# EAGLE design RTI-Dome-eth-ENC (EAGLE 7.7.0)

## Sheet 1 of 2
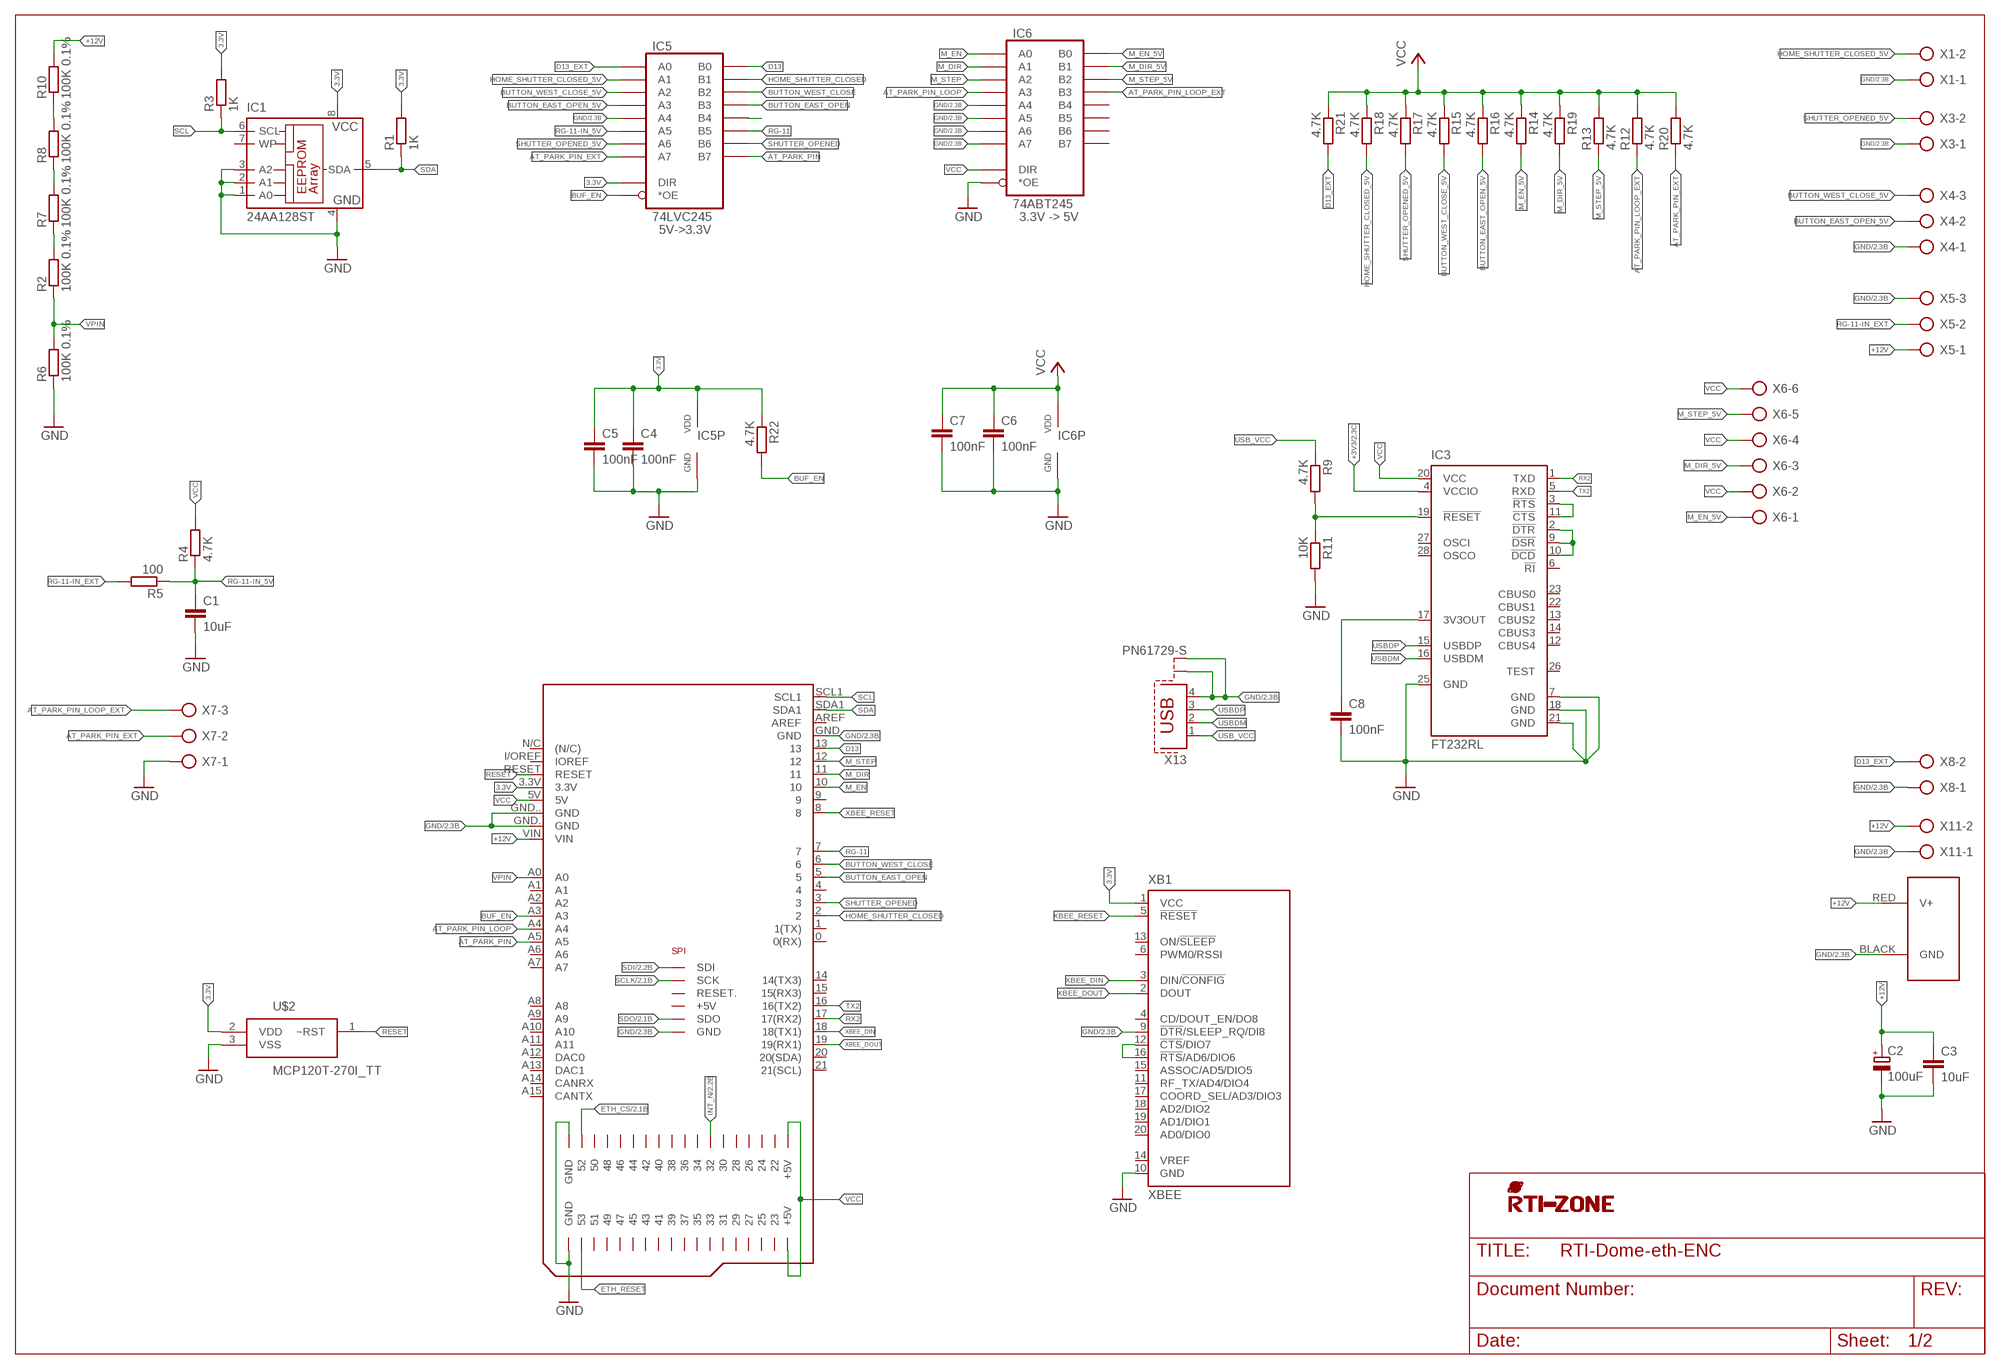
[diagram p0: schematic, sheet 1]

### Parts
C1  10uF  C-EU'0805'  [C0805]
C2  100uF  CPOL-EU  [UD-10X10_NICHICON]
C3  10uF  C-EU'0805'  [C0805]
C4  100nF  C-EU'0805'  [C0805]
C5  100nF  C-EU'0805'  [C0805]
C6  100nF  C-EU'0805'  [C0805]
C7  100nF  C-EU'0805'  [C0805]
C8  100nF  C-EU'0805'  [C0805]
IC1  24AA128ST  [TSSOP8]
IC3  FT232RL  [SSOP28]
IC5  74LVC245  [TSSOP20]
IC6  74ABT245  [TSSOP20]
J1  POWERPOLE_POWER45A  [POWERPOLE_PAIR_45A]
R1  1K  R-EU'0805'  [R0805]
R2  100K 0.1%  R-EU'0805'  [R0805]
R3  1K  R-EU'0805'  [R0805]
R4  4.7K  R-EU'0805'  [R0805]
R5  100  R-EU'0805'  [R0805]
R6  100K 0.1%  R-EU'0805'  [R0805]
R7  100K 0.1%  R-EU'0805'  [R0805]
R8  100K 0.1%  R-EU'0805'  [R0805]
R9  4.7K  R-EU'0805'  [R0805]
R10  100K 0.1%  R-EU'0805'  [R0805]
R11  10K  R-EU'0805'  [R0805]
R12  4.7K  R-EU'0805'  [R0805]
R13  4.7K  R-EU'0805'  [R0805]
R14  4.7K  R-EU'0805'  [R0805]
R15  4.7K  R-EU'0805'  [R0805]
R16  4.7K  R-EU'0805'  [R0805]
R17  4.7K  R-EU'0805'  [R0805]
R18  4.7K  R-EU'0805'  [R0805]
R19  4.7K  R-EU'0805'  [R0805]
R20  4.7K  R-EU'0805'  [R0805]
R21  4.7K  R-EU'0805'  [R0805]
R22  4.7K  R-EU'0805'  [R0805]
U$1  ARDUINO_DUE_SHIELD_FULL  [ARDUINO_DUE_SHIELD_FULL]
U$2  MCP120T-270I_TT  [SOT95P237X112-3N]
U$4  RTI-LOGO_BIG  [LOGO_BIG]
X1  AK500/2  [AK500/2]
X3  AK500/2  [AK500/2]
X4  AK500/3  [AK500/3]
X5  AK500/3  [AK500/3]
X6  AK500/6  [AK500/6]
X7  AK500/3  [AK500/3]
X8  AK500/2  [AK500/2]
X11  AK500/2  [AK500/2]
X13  PN61729-S  [PN61729-S]
XB1  XBEE  [XBEE]

### Nets
3.3V: C4.1 C5.1 IC1.8(VCC) IC5.P$1(DIR) IC5.P$20(VDD) R1.2 R3.2 R22.1 U$1.3.3V U$2.2(VDD) XB1.1(VCC)
+3V3 [+3V3]: IC3.4(VCCIO) ; also sheet 2
+12V [+12V]: C2.+ C3.1 J1.RED(V+) R10.2 U$1.VIN X5.1 X11.2
AT_PARK_PIN: IC5.P$11(B7) U$1.A5
AT_PARK_PIN_EXT: IC5.P$9(A7) R20.1 X7.2
AT_PARK_PIN_LOOP: IC6.P$5(A3) U$1.A4
AT_PARK_PIN_LOOP_EXT: IC6.P$15(B3) R12.1 X7.3
BUF_EN: IC5.P$19(*OE) R22.2 U$1.A3
BUTTON_EAST_OPEN: IC5.P$15(B3) U$1.5
BUTTON_EAST_OPEN_5V: IC5.P$5(A3) R16.2 X4.2
BUTTON_WEST_CLOSE: IC5.P$16(B2) U$1.6
BUTTON_WEST_CLOSE_5V: IC5.P$4(A2) R15.2 X4.3
D13: IC5.P$18(B0) U$1.13
D13_EXT: IC5.P$2(A0) R21.2 X8.2
DTR_DSR_DCD: IC3.2(!DTR) IC3.9(!DSR) IC3.10(!DCD)
ETH_CS: U$1.52 ; also sheet 2
ETH_RESET: U$1.53
GND [GND]: C1.2 C2.- C3.2 C4.2 C5.2 C6.2 C7.2 C8.2 IC1.1(A0) IC1.2(A1) IC1.3(A2) IC1.4(GND) IC3.7(GND) IC3.18(GND) IC3.21(GND) IC3.25(GND) IC5.P$6(A4) IC5.P$10(GND) IC6.P$6(A4) IC6.P$7(A5) IC6.P$8(A6) IC6.P$9(A7) IC6.P$10(GND) IC6.P$19(*OE) J1.BLACK(GND) R6.1 R11.2 U$1.GND U$1.GND.(GND) U$1.GND..(GND) U$1.GND...(GND) U$1.GND....(GND) U$1.GND__(GND) U$2.3(VSS) X1.1 X3.1 X4.1 X5.3 X7.1 X8.1 X11.1 X13.4 X13.S1 X13.S2 XB1.9(!DTR!/SLEEP_RQ/DI8) XB1.10(GND) ; also sheet 2
HOME_SHUTTER_CLOSED: IC5.P$17(B1) U$1.2
HOME_SHUTTER_CLOSED_5V: IC5.P$3(A1) R18.2 X1.2
INT_N: U$1.32 ; also sheet 2
M_DIR: IC6.P$3(A1) U$1.11
M_DIR_5V: IC6.P$17(B1) R19.2 X6.3
M_EN: IC6.P$2(A0) U$1.10
M_EN_5V: IC6.P$18(B0) R14.2 X6.1
M_STEP: IC6.P$4(A2) U$1.12
M_STEP_5V: IC6.P$16(B2) R13.1 X6.5
N$1: IC3.19(!RESET) R9.2 R11.1
N$2: R7.2 R8.1
N$3: R8.2 R10.1
N$4: IC5.P$14(B4)
N$5: R2.2 R7.1
N$6: C8.1 IC3.17(3V3OUT)
N$9: XB1.12(!CTS!/DIO7) XB1.16(!RTS!/AD6/DIO6)
RESET: U$1.RESET U$2.1(~RST)
RG-11: IC5.P$13(B5) U$1.7
RG-11-IN_5V: C1.1 IC5.P$7(A5) R4.1 R5.1
RG-11-IN_EXT: R5.2 X5.2
RTS_CTS: IC3.3(!RTS) IC3.11(!CTS)
RX2: IC3.1(TXD) U$1.17(17(RX2))
SCL: IC1.6(SCL) R3.1 U$1.SCL1
SCLK: U$1.SCK ; also sheet 2
SDA: IC1.5(SDA) R1.1 U$1.SDA1
SDI: U$1.MISO(SDI) ; also sheet 2
SDO: U$1.MOSI(SDO) ; also sheet 2
SHUTTER_OPENED: IC5.P$12(B6) U$1.3
SHUTTER_OPENED_5V: IC5.P$8(A6) R17.2 X3.2
TX2: IC3.5(RXD) U$1.16(16(TX2))
USB_VCC: R9.1 X13.1
USBDM: IC3.16(USBDM) X13.2
USBDP: IC3.15(USBDP) X13.3
VCC: C6.1 C7.1 IC3.20(VCC) IC6.P$1(DIR) IC6.P$20(VDD) R4.2 R12.2 R13.2 R14.1 R15.1 R16.1 R17.1 R18.1 R19.1 R20.2 R21.1 U$1.5V U$1.5V.(+5V) U$1.5V..(+5V) X6.2 X6.4 X6.6 ; also sheet 2
VPIN: R2.1 R6.2 U$1.A0
XBEE_DIN: U$1.18(18(TX1)) XB1.3(DIN/!CONFIG)
XBEE_DOUT: U$1.19(19(RX1)) XB1.2(DOUT)
XBEE_RESET: U$1.8 XB1.5(!RESET)
Unconnected: IC1.7(WP) IC3.6(!RI) IC3.12(CBUS4) IC3.13(CBUS2) IC3.14(CBUS3) IC3.22(CBUS1) IC3.23(CBUS0) IC3.26(TEST) IC3.27(OSCI) IC3.28(OSCO) IC6.P$11(B7) IC6.P$12(B6) IC6.P$13(B5) IC6.P$14(B4) U$1.0(0(RX)) U$1.1(1(TX)) U$1.4 U$1.9 U$1.14(14(TX3)) U$1.15(15(RX3)) U$1.20(20(SDA)) U$1.21(21(SCL)) U$1.22 U$1.23 U$1.24 U$1.25 U$1.26 U$1.27 U$1.28 U$1.29 U$1.30 U$1.31 U$1.33 U$1.34 U$1.35 U$1.36 U$1.37 U$1.38 U$1.39 U$1.40 U$1.41 U$1.42 U$1.43 U$1.44 U$1.45 U$1.46 U$1.47 U$1.48 U$1.49 U$1.50 U$1.51 U$1.A1 U$1.A2 U$1.A6 U$1.A7 U$1.A8 U$1.A9 U$1.A10 U$1.A11 U$1.A12(DAC0) U$1.A13(DAC1) U$1.A14(CANRX) U$1.A15(CANTX) U$1.AREF U$1.I/OREF(IOREF) U$1.N/C((N/C)) U$1.RESET. XB1.4(CD/DOUT_EN/DO8) XB1.6(PWM0/RSSI) XB1.11(RF_TX/AD4/DIO4) XB1.13(ON/!SLEEP) XB1.14(VREF) XB1.15(ASSOC/AD5/DIO5) XB1.17(COORD_SEL/AD3/DIO3) XB1.18(AD2/DIO2) XB1.19(AD1/DIO1) XB1.20(AD0/DIO0)

### Notes on the sheet
- 3.3V -> 5V
- 5V->3.3V

## Sheet 2 of 2
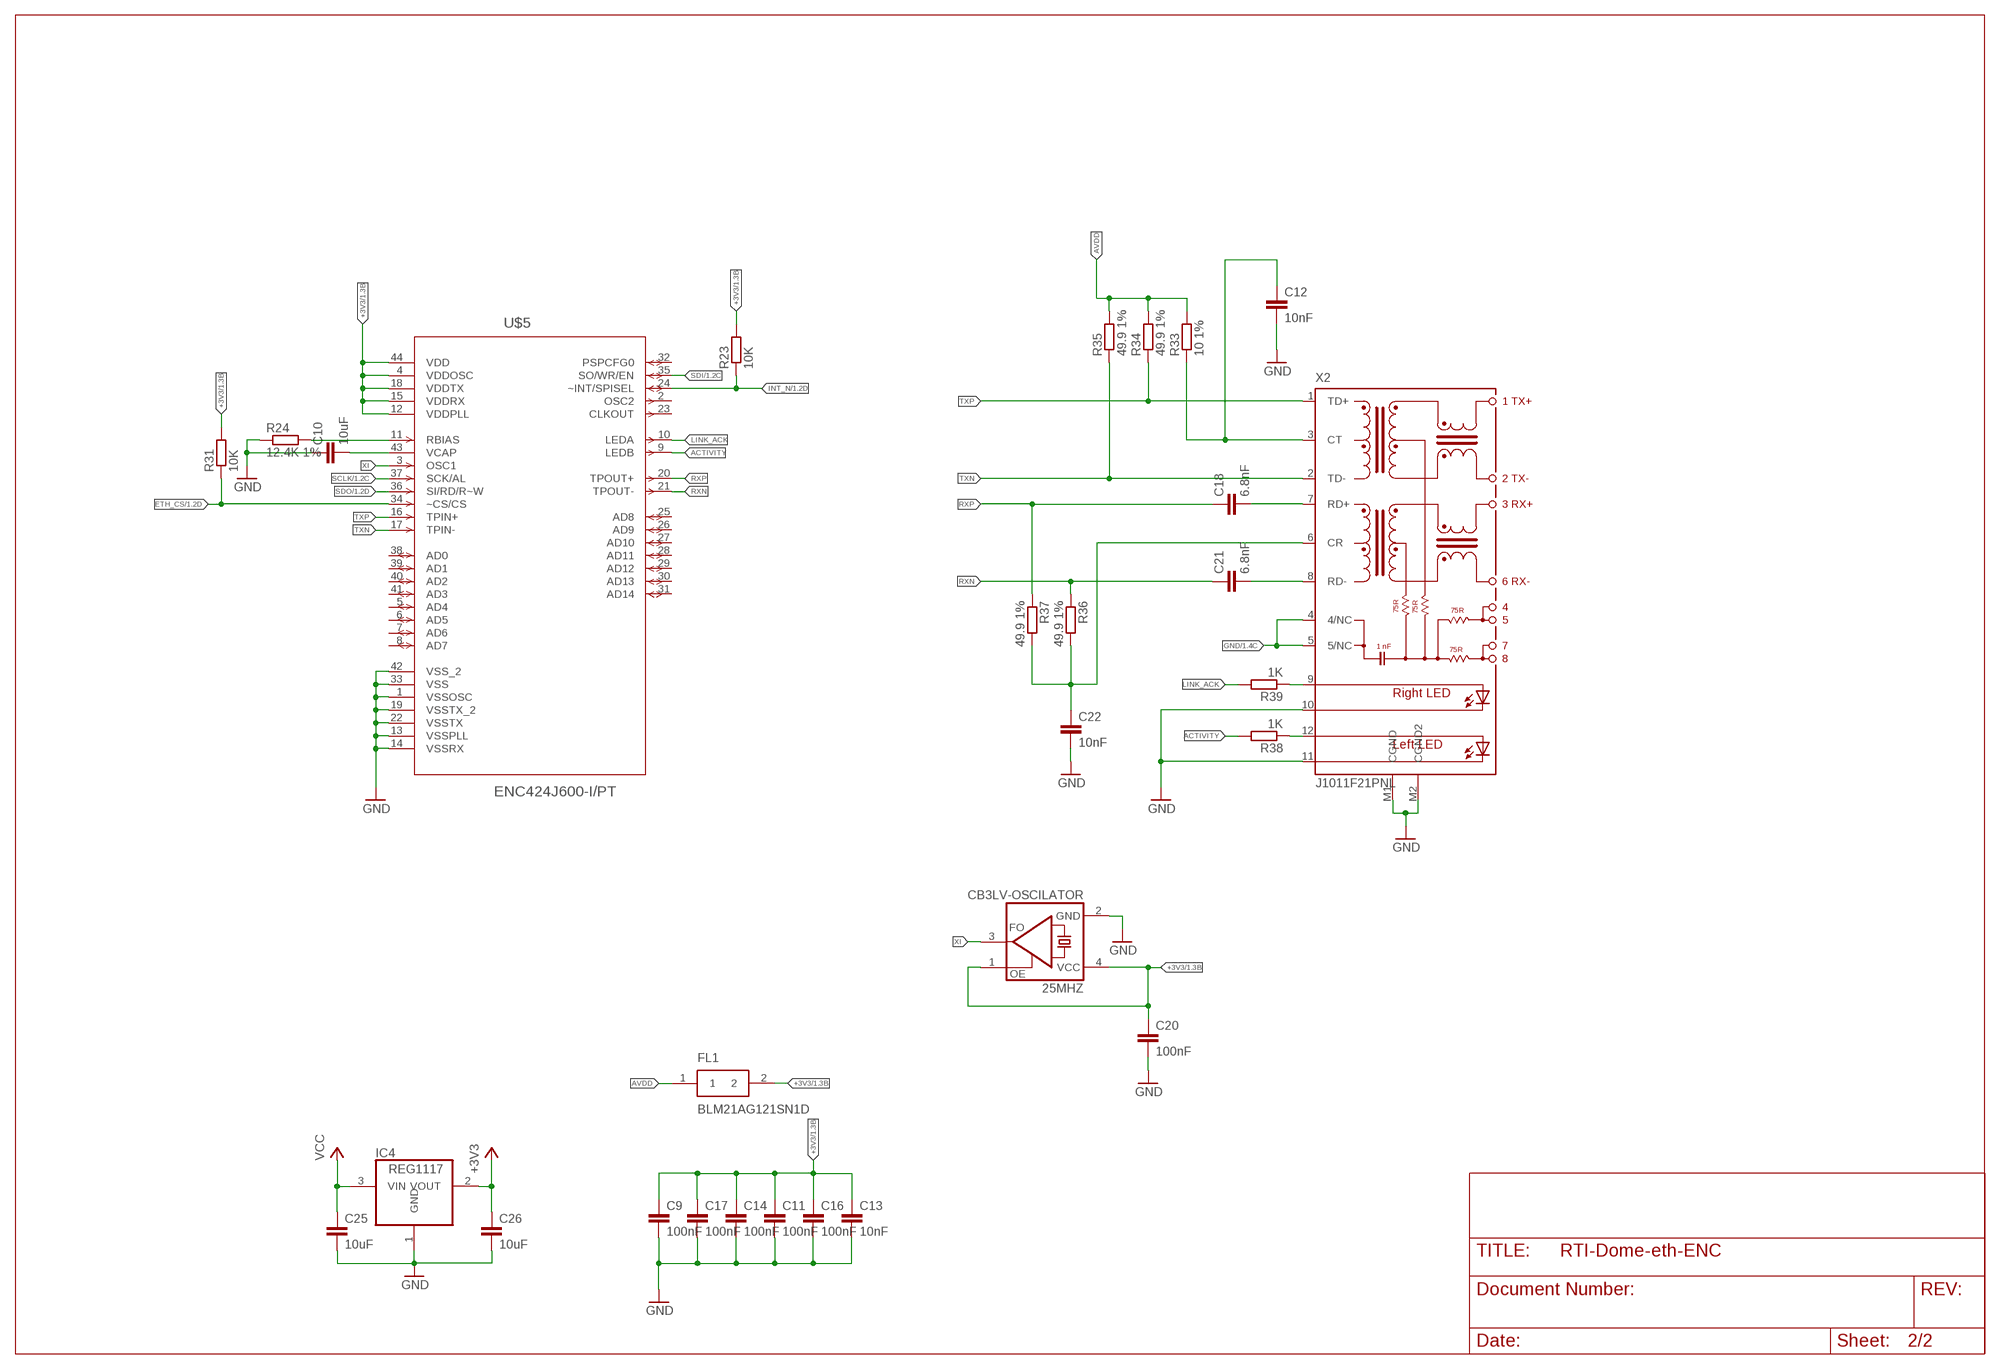
[diagram p1: schematic, sheet 2]

### Parts
25MHZ  CB3LV-OSCILATOR  [SMD-7050_4P]
C9  100nF  C-EU'0805'  [C0805]
C10  10uF  C-EU'0805'  [C0805]
C11  100nF  C-EU'0805'  [C0805]
C12  10nF  C-EU'0805'  [C0805]
C13  10nF  C-EU'0805'  [C0805]
C14  100nF  C-EU'0805'  [C0805]
C16  100nF  C-EU'0805'  [C0805]
C17  100nF  C-EU'0805'  [C0805]
C18  6.8nF  C-EU'0805'  [C0805]
C20  100nF  C-EU'0805'  [C0805]
C21  6.8nF  C-EU'0805'  [C0805]
C22  10nF  C-EU'0805'  [C0805]
C25  10uF  C-EU'1206'  [C1206]
C26  10uF  C-EU'1206'  [C1206]
FL1  BLM21AG121SN1D  [L0805]
IC4  REG1117  [SOT223]
R23  10K  R-EU'0805'  [R0805]
R24  12.4K 1%  R-EU'0805'  [R0805]
R31  10K  R-EU'0805'  [R0805]
R33  10 1%  R-EU'0805'  [R0805]
R34  49.9 1%  R-EU'0805'  [R0805]
R35  49.9 1%  R-EU'0805'  [R0805]
R36  49.9 1%  R-EU'0805'  [R0805]
R37  49.9 1%  R-EU'0805'  [R0805]
R38  1K  R-EU'0805'  [R0805]
R39  1K  R-EU'0805'  [R0805]
U$5  ENC424J600-I/PT  [QFP50P1200X1200X120-44N]
X2  J1011F21PNL  [J1]

### Nets
+3V3 [+3V3]: 25MHZ.1(OE) 25MHZ.4(VDD) C9.1 C11.1 C13.1 C14.1 C16.1 C17.1 C20.1 C26.1 FL1.2 IC4.2(VOUT) R23.2 R31.2 U$5.4(VDDOSC) U$5.12(VDDPLL) U$5.15(VDDRX) U$5.18(VDDTX) U$5.44(VDD) ; also sheet 1
ACTIVITY: R38.2 U$5.9(LEDB)
AVDD: FL1.1 R33.2 R34.2 R35.2
ETH_CS: R31.1 U$5.34(~CS/CS) ; also sheet 1
GND [GND]: 25MHZ.2(GND) C9.2 C10.1 C11.2 C12.2 C13.2 C14.2 C16.2 C17.2 C20.2 C22.2 C25.2 C26.2 IC4.1(GND) R24.1 U$5.1(VSSOSC) U$5.13(VSSPLL) U$5.14(VSSRX) U$5.19(VSSTX_2) U$5.22(VSSTX) U$5.33(VSS) U$5.42(VSS_2) X2.4(4/NC) X2.5(5/NC) X2.10(C-R) X2.11(C-L) X2.M1(CGND) X2.M2(CGND2) ; also sheet 1
INT_N: R23.1 U$5.24(~INT/SPISEL) ; also sheet 1
LINK_ACK: R39.2 U$5.10(LEDA)
N$7: R24.2 U$5.11(RBIAS)
N$8: C10.2 U$5.43(VCAP)
N$10: R39.1 X2.9(A-R)
N$13 [+3V3]: C22.1 R36.2 R37.2 X2.6(CR)
N$14: R38.1 X2.12(AL)
N$16: C18.2 X2.7(RD+)
N$17: C21.2 X2.8(RD-)
N$18 [+3V3]: C12.1 R33.1 X2.3(CT)
RXN: C21.1 R36.1 U$5.21(TPOUT-)
RXP: C18.1 R37.1 U$5.20(TPOUT+)
SCLK: U$5.37(SCK/AL) ; also sheet 1
SDI: U$5.35(SO/WR/EN) ; also sheet 1
SDO: U$5.36(SI/RD/R~W) ; also sheet 1
TXN [diff]: R35.1 U$5.17(TPIN-) X2.2(TD-)
TXP: R34.1 U$5.16(TPIN+) X2.1(TD+)
VCC: C25.1 IC4.3(VIN) ; also sheet 1
XI: 25MHZ.3(FO) U$5.3(OSC1)
Unconnected: U$5.2(OSC2) U$5.5(AD4) U$5.6(AD5) U$5.7(AD6) U$5.8(AD7) U$5.23(CLKOUT) U$5.25(AD8) U$5.26(AD9) U$5.27(AD10) U$5.28(AD11) U$5.29(AD12) U$5.30(AD13) U$5.31(AD14) U$5.32(PSPCFG0) U$5.38(AD0) U$5.39(AD1) U$5.40(AD2) U$5.41(AD3)

## Power pins joined to a net without a drawn wire
+5V: U$1.+5V_(+5V)

## Library data of the parts
25MHZ = rti:CB3LV-OSCILATOR; MPN: O705025MEDH4MI
C1 C3-C14 C16-C18 C20-C22 C25 C26 = rti:C-EU
C2 = rti:CPOL-EU
FL1 = BLM21AG121SN1D:BLM21AG121SN1D: BLM21_N1D Series EMI Suppression Filter 120+/-25% at 100MHz 1A @85 Source: Datasheet <https://www.murata.com/en-us/products/productdetail?partno=BLM21AG121SN1#>
IC1 = microchip:24*: Serial EEPROM I2C; MF: MICROCHIP; MPN: 24AA128-I/ST; OC_FARNELL: unknown; OC_NEWARK: 92C6843
IC3 = ftdichip:FT232R: Source: http://www.ftdichip.com/Documents/DataSheets/DS_FT232R_v104.pdf; MPN: FT232RL; OC_FARNELL: 1146032; OC_NEWARK: 91K9918
IC4 = burr-brown:REG1117: 800mA and 1A Low Dropout (LDO) Positive Regulator 1.8V, 2.5V, 2.85V, 3.3V, 5V, and Adj; MPN: REG1117-3.3/2K5; OC_FARNELL: 1097566; OC_NEWARK: 14P6981
IC5 = rti:74*245; MPN: 74LVC245APW,118
IC6 = rti:74*245; MPN: SN74ABT245BDWR
J1 = powerpoles:POWERPOLE_POWER: Anderson Powerpole Power Connector using ameteur radio standard layout
R1-R24 R31 R33-R39 = rti:R-EU
U$1 = arduino_shield:ARDUINO_DUE_SHIELD_FULL
U$2 = MCP120T-270I_TT:MCP120T-270I_TT: Microcontroller Supervisory Circuit Source: Datasheet; DESCRIPTION: Microcontroller Supervisory Circuit; HEIGHT: mm; MANUFACTURER_NAME: Microchip; MANUFACTURER_PART_NUMBER: MCP120T-270I/TT; MOUSER_PART_NUMBER: 579-MCP120T-270I/TT; MOUSER_PRICE-STOCK: https://www.mouser.co.uk/ProductDetail/Microchip-Technology/MCP120T-270I-TT?qs=JaP0%252BruNJH91Pwyk6aJdSA%3D%3D; MPN: MCP120T-270I/TT
U$4 = rti:RTI-LOGO
U$5 = Microchip_By_element14_Batch_1:ENC424J600-I/PT: Stand-Alone 10/100 Ethernet Controller; DESCRIPTION: Stand-Alone 10/100 Ethernet Controller; MPN: ENC424J600-I/PT; OC_FARNELL: 1740226; OC_NEWARK: 07P9120; PACKAGE: TQFP-44; SUPPLIER: Microchip
X1 X3 X8 X11 = con-ptr500:AK500/2: CONNECTOR; OC_FARNELL: unknown; OC_NEWARK: unknown
X2 = rti:J1011F: PULSEJACK (TM) 1x1 Tab-UP RJ45 10/100 Base-TX RJ45 1x1 Tab-UP with LEDs 8-pin (J1 series) and 6-pin (JP series) integrated magnetics connector, designed to support applications, such as ADSL modems, LAN-on-Motherboard, and Hub and Switches. Source: www.pulseeng.com .. PulseJack-J402.pdf
X4 X5 X7 = con-ptr500:AK500/3: CONNECTOR; OC_FARNELL: unknown; OC_NEWARK: unknown
X6 = con-ptr500:AK500/6: CONNECTOR; OC_FARNELL: unknown; OC_NEWARK: unknown
X13 = con-berg:PN61729-S: BERG USB connector; OC_FARNELL: unknown; OC_NEWARK: unknown
XB1 = maxstream:XBEE: XBee (TM) /XBee-PRO(TM) OEM RF Modules Source: MaxStream, Inc. xbee_productmanual.pdf; MPN: XBP24-Z7UIT-004; OC_FARNELL: 1751799; OC_NEWARK: 34R5507

## Net classes
0 default: width 0.254 mm, drill 0.3 mm, clearance 0.152 mm
1 +12V: width 0.254 mm, drill 0.3 mm, clearance 0.152 mm
2 GND: width 0.254 mm, drill 0.3 mm, clearance 0.152 mm
3 +3V3: width 0.254 mm, drill 0.254 mm, clearance 0.152 mm
4 diff: width 0.254 mm, drill 0.254 mm, clearance 0.152 mm

## Board
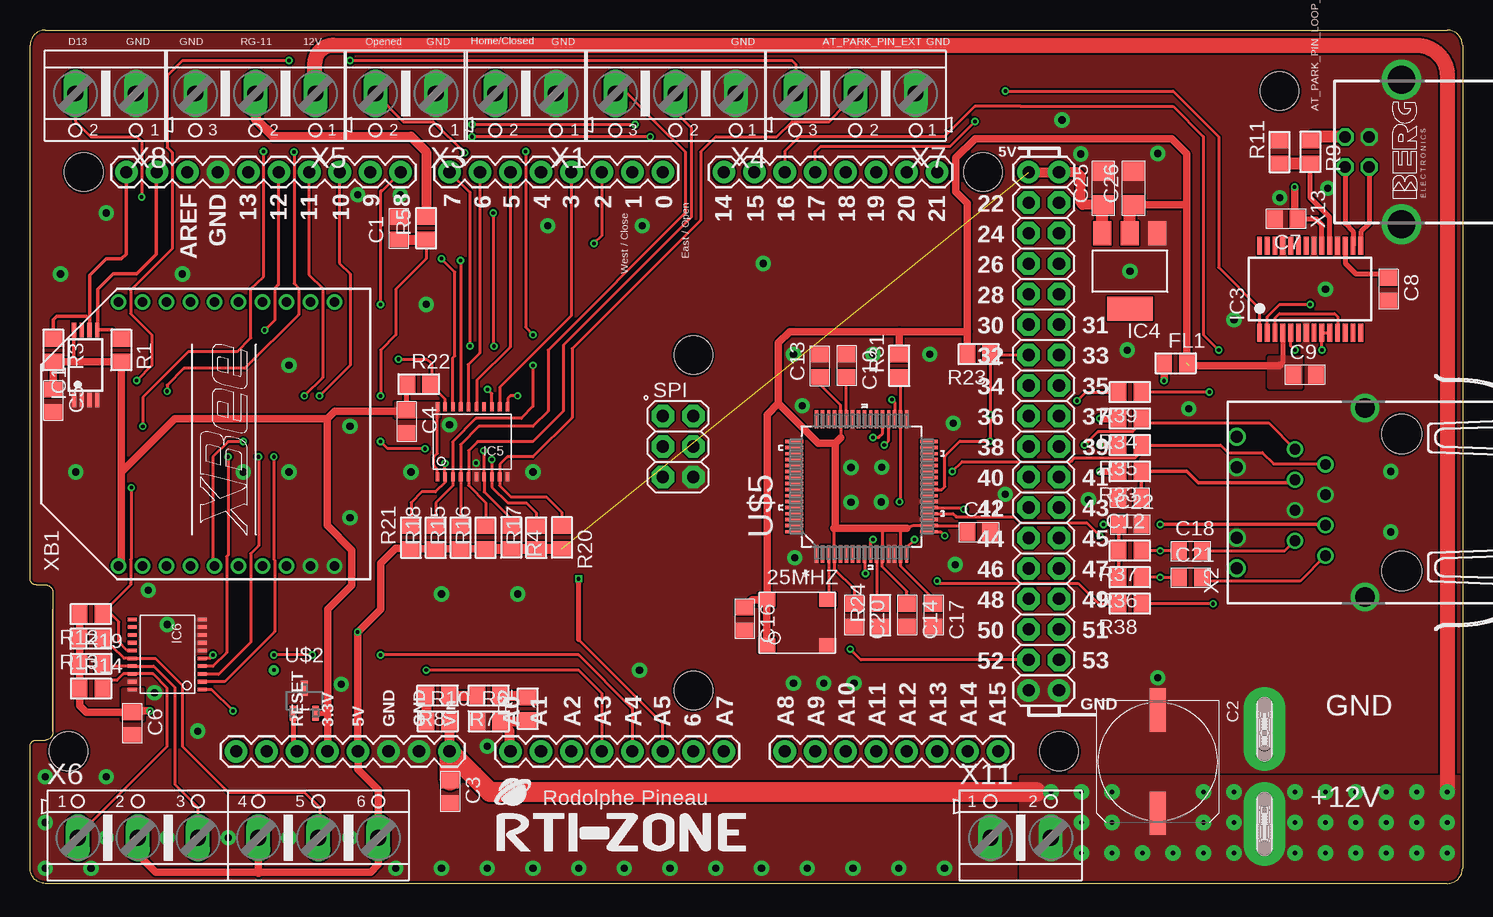
[diagram p2: board, top side]
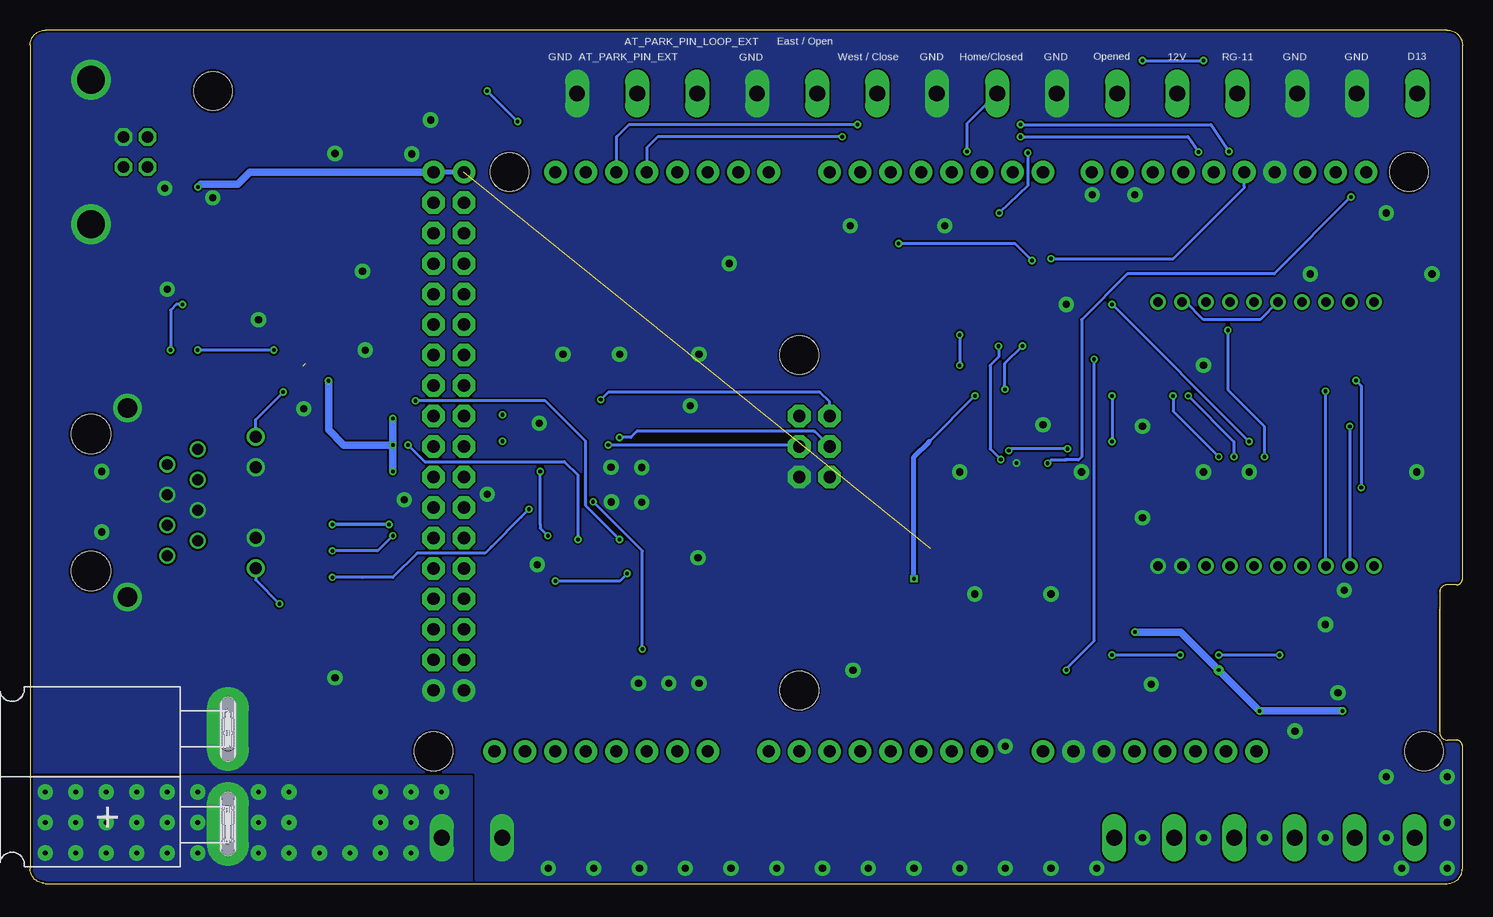
[diagram p3: board, bottom side, seen from below]

Size 119.38 x 71.12 mm. Coordinates in mm from the lower left corner, seen from the top.
Outline: 1.91,22.86 1.91,12.7
Outline: 1.91,12.7 1.91,22.86
Outline: 1.91,12.7 arc-90 1.27,11.94 0.51,11.94 arc90 0,11.43 0,1.27 arc90 1.27,0 118.11,0 arc90 119.38,1.27 119.38,69.85 arc90 118.11,71.12 1.27,71.12 arc90 0,69.85 0,25.4 arc90 0.51,24.89 1.27,24.89 arc-90 1.91,24.26 1.91,22.86
Copper layers (1*16): Top 0.35mm / dielectric 1.6mm / Bottom 0.35mm
Design rules "jlcpcb2layer": minimum track width 5mil, minimum drill 0.2mm, track to track 5mil, track to pad 5mil, pad to pad 5mil, via to via 5mil, smd to smd 5mil, copper to edge 8mil, drill to drill 0.5mm, minimum pad ring 6mil, minimum via ring 6mil, stop-mask expansion 0.05mm, vias tented up to drill 130mil, thermal gap 8mil
Holes 3.2 mm at 104.14,66.04

### Footprints (pad centres in the part's own frame; a part is rotated, then mirrored left to right if it is on the bottom)
SMD-7050_4P = smd 1.397 x 1.194: 1 -2.54,-1.27; 2 2.54,-1.27; 3 2.54,2.54; 4 -2.54,2.54
C0805 = smd 1.3 x 1.5: 1 -0.95,0; 2 0.95,0
UD-10X10_NICHICON = smd 3.6 x 1.3: + 4.3,0; - -4.3,0
C1206 = smd 1.6 x 1.8: 1 -1.4,0; 2 1.4,0
L0805 = smd 1.3 x 1.5: 1 -0.95,0; 2 0.95,0
TSSOP8 = smd 0.35 x 1.2: 1 -0.975,-2.925; 2 -0.325,-2.925; 3 0.325,-2.925; 4 0.975,-2.925; 5 0.975,2.925; 6 0.325,2.925; 7 -0.325,2.925; 8 -0.975,2.925
SSOP28 = smd 0.4 x 1.5: 1 -4.225,-3.625; 2 -3.575,-3.625; 3 -2.925,-3.625; 4 -2.275,-3.625; 5 -1.625,-3.625; 6 -0.975,-3.625; 7 -0.325,-3.625; 8 0.325,-3.625; 9 0.975,-3.625; 10 1.625,-3.625; 11 2.275,-3.625; 12 2.925,-3.625; 13 3.575,-3.625; 14 4.225,-3.625; 15 4.225,3.625; 16 3.575,3.625; 17 2.925,3.625; 18 2.275,3.625; 19 1.625,3.625; 20 0.975,3.625; 21 0.325,3.625; 22 -0.325,3.625; 23 -0.975,3.625; 24 -1.625,3.625; 25 -2.275,3.625; 26 -2.925,3.625; 27 -3.575,3.625; 28 -4.225,3.625
SOT223 = smd 1.499 x 2.007: 1 -2.261,-3.15; 2 0.025,-3.15; 3 2.311,-3.15 | smd 3.81 x 2.007: 4 0,3.15
TSSOP20 = smd 0.75 x 0.3: P$1 -2.94,2.885; P$2 -2.94,2.235; P$3 -2.94,1.585; P$4 -2.94,0.935; P$5 -2.94,0.285; P$6 -2.94,-0.365; P$7 -2.94,-1.015; P$8 -2.94,-1.665; P$9 -2.94,-2.315; P$10 -2.94,-2.965; P$11 2.91,-2.965; P$12 2.91,-2.315; P$13 2.91,-1.665; P$14 2.91,-1.015; P$15 2.91,-0.365; P$16 2.91,0.285; P$17 2.91,0.935; P$18 2.91,1.585; P$19 2.91,2.235; P$20 2.91,2.885
POWERPOLE_PAIR_45A = drill 1.27 pad 3.5 long: BLACK 3.97,0.02; RED -3.93,0.02 | hole 1.27: -1.95,0.02; -5.91,0.02; 1.99,0.02; 5.95,0.02; -4.64,0.02; -3.37,0.02; 3.26,0.02; 4.68,0.02; -5.656,0.02; -5.783,0.02; -5.529,0.02; -5.402,0.02; -5.275,0.02; -5.148,0.02; -5.021,0.02; -4.894,0.02; -4.767,0.02; -2.077,0.02; -2.204,0.02; -2.331,0.02; -2.458,0.02; -2.585,0.02; -2.712,0.02; -2.966,0.02; -2.839,0.02; -3.093,0.02; -3.22,0.02; -3.497,0.02; -3.624,0.02; -3.751,0.02; -3.878,0.02; -4.005,0.02; -4.132,0.02; -4.259,0.02; -4.386,0.02; -4.513,0.02; 5.823,0.02; 5.696,0.02; 5.569,0.02; 5.442,0.02; 5.315,0.02; 5.188,0.02; 5.061,0.02; 4.934,0.02; 4.807,0.02; 4.553,0.02; 4.426,0.02; 4.299,0.02; 4.045,0.02; 4.045,0.02; 4.172,0.02; 3.918,0.02; 3.791,0.02; 3.791,0.02; 3.664,0.02; 3.664,0.02; 3.664,0.02; 3.537,0.02; 3.537,0.02; 3.41,0.02; 3.133,0.02; 3.006,0.02; 2.879,0.02; 2.752,0.02; 2.625,0.02; 2.498,0.02; 2.371,0.02; 2.244,0.02; 2.117,0.02
R0805 = smd 1.3 x 1.5: 1 -0.95,0; 2 0.95,0
ARDUINO_DUE_SHIELD_FULL = drill 1.016 pad 1.88: 0 13.97,24.13; 1 11.43,24.13; 2 8.89,24.13; 3 6.35,24.13; 3.3V -13.97,-24.13; 4 3.81,24.13; 5 1.27,24.13; 5V -11.43,-24.13; 5V. 44.45,24.13; 5V.. 46.99,24.13; 6 -1.27,24.13; 7 -3.81,24.13; 8 -7.874,24.13; 9 -10.414,24.13; 10 -12.954,24.13; 11 -15.494,24.13; 12 -18.034,24.13; 13 -20.574,24.13; 14 19.05,24.13; 15 21.59,24.13; 16 24.13,24.13; 17 26.67,24.13; 18 29.21,24.13; 19 31.75,24.13; 20 34.29,24.13; 21 36.83,24.13; A0 1.27,-24.13; A1 3.81,-24.13; A2 6.35,-24.13; A3 8.89,-24.13; A4 11.43,-24.13; A5 13.97,-24.13; A6 16.51,-24.13; A7 19.05,-24.13; A8 24.13,-24.13; A9 26.67,-24.13; A10 29.21,-24.13; A11 31.75,-24.13; A12 34.29,-24.13; A13 36.83,-24.13; A14 39.37,-24.13; A15 41.91,-24.13; AREF -25.654,24.13; GND -23.114,24.13; GND. -6.35,-24.13; GND.. -8.89,-24.13; GND... 44.45,-19.05; GND.... 46.99,-19.05; I/OREF -19.05,-24.13; N/C -21.59,-24.13; RESET -16.51,-24.13; SCL1 -30.734,24.13; SDA1 -28.194,24.13; VIN -3.81,-24.13 | drill 1.016 pad 1.88 octagon: 22 44.45,21.59; 23 46.99,21.59; 24 44.45,19.05; 25 46.99,19.05; 26 44.45,16.51; 27 46.99,16.51; 28 44.45,13.97; 29 46.99,13.97; 30 44.45,11.43; 31 46.99,11.43; 32 44.45,8.89; 33 46.99,8.89; 34 44.45,6.35; 35 46.99,6.35; 36 44.45,3.81; 37 46.99,3.81; 38 44.45,1.27; 39 46.99,1.27; 40 44.45,-1.27; 41 46.99,-1.27; 42 44.45,-3.81; 43 46.99,-3.81; 44 44.45,-6.35; 45 46.99,-6.35; 46 44.45,-8.89; 47 46.99,-8.89; 48 44.45,-11.43; 49 46.99,-11.43; 50 44.45,-13.97; 51 46.99,-13.97; 52 44.45,-16.51; 53 46.99,-16.51; +5V_ 16.51,3.81; GND__ 16.51,-1.27; MISO 13.97,3.81; MOSI 16.51,1.27; RESET. 13.97,-1.27; SCK 13.97,1.27 | hole 3.2: -34.29,24.13; -35.56,-24.13; 16.51,8.89; 16.51,-19.05; 40.64,24.13; 46.99,-24.13
SOT95P237X112-3N = smd 0.559 x 1.27: 1 -0.94,-1.041; 2 0.94,-1.041; 3 0,1.041
QFP50P1200X1200X120-44N = smd 1.473 x 0.279: 1 -5.613,3.759; 2 -5.613,3.251; 3 -5.613,2.743; 4 -5.613,2.261; 5 -5.613,1.753; 6 -5.613,1.245; 7 -5.613,0.762; 8 -5.613,0.254; 9 -5.613,-0.254; 10 -5.613,-0.762; 11 -5.613,-1.245; 12 -5.613,-1.753; 13 -5.613,-2.261; 14 -5.613,-2.743; 15 -5.613,-3.251; 16 -5.613,-3.759; 33 5.613,-3.759; 34 5.613,-3.251; 35 5.613,-2.743; 36 5.613,-2.261; 37 5.613,-1.753; 38 5.613,-1.245; 39 5.613,-0.762; 40 5.613,-0.254; 41 5.613,0.254; 42 5.613,0.762; 43 5.613,1.245; 44 5.613,1.753; 45 5.613,2.261; 46 5.613,2.743; 47 5.613,3.251; 48 5.613,3.759 | smd 0.279 x 1.473: 17 -3.759,-5.613; 18 -3.251,-5.613; 19 -2.743,-5.613; 20 -2.261,-5.613; 21 -1.753,-5.613; 22 -1.245,-5.613; 23 -0.762,-5.613; 24 -0.254,-5.613; 25 0.254,-5.613; 26 0.762,-5.613; 27 1.245,-5.613; 28 1.753,-5.613; 29 2.261,-5.613; 30 2.743,-5.613; 31 3.251,-5.613; 32 3.759,-5.613; 49 3.759,5.613; 50 3.251,5.613; 51 2.743,5.613; 52 2.261,5.613; 53 1.753,5.613; 54 1.245,5.613; 55 0.762,5.613; 56 0.254,5.613; 57 -0.254,5.613; 58 -0.762,5.613; 59 -1.245,5.613; 60 -1.753,5.613; 61 -2.261,5.613; 62 -2.743,5.613; 63 -3.251,5.613; 64 -3.759,5.613
AK500/2 = drill 1.321 long: 1 -2.515,0; 2 2.515,0
J1 = drill 0.9 pad 1.3: 1 4.445,2.54; 2 3.175,0; 3 1.905,2.54; 4 0.635,0; 5 -0.635,2.54; 6 -1.905,0; 7 -3.175,2.54; 8 -4.445,0 | drill 1 pad 1.422: 9 5.465,7.37; 10 2.925,7.37; 11 -2.925,7.37; 12 -5.465,7.37 | drill 1.6 pad 2.184: M1 -7.875,-3.3; M2 7.875,-3.3 | hole 3.3: 5.715,-6.35; -5.715,-6.35
AK500/3 = drill 1.321 long: 1 -5.004,0; 2 0,0; 3 5.004,0
AK500/6 = drill 1.321 long: 1 -12.522,0; 2 -7.518,0; 3 -2.515,0; 4 2.515,0; 5 7.518,0; 6 12.522,0
PN61729-S = drill 0.95 octagon: 1 1.25,4.71; 2 -1.25,4.71; 3 -1.25,2.71; 4 1.25,2.71 | drill 2.3 pad 2.9: S1 -6.02,0; S2 6.02,0
XBEE = drill 0.8 pad 1.27: 1 -11,9; 2 -11,7; 3 -11,5; 4 -11,3; 5 -11,1; 6 -11,-1; 7 -11,-3; 8 -11,-5; 9 -11,-7; 10 -11,-9; 11 11,-9; 12 11,-7; 13 11,-5; 14 11,-3; 15 11,-1; 16 11,1; 17 11,3; 18 11,5; 19 11,7; 20 11,9

### Placement (x,y rotation side)
25MHZ  63.95,21.11 0 top
C1  30.73,54.61 90 top
C2  93.98,10.16 270 top
C3  34.99,7.65 270 top
C4  31.37,38.48 270 top
C5  1.94,40.23 270 top
C6  8.51,13.34 270 top
C7  104.68,55.37 180 top
C8  113.19,49.53 270 top
C9  106.23,42.41 0 top
C10  68.04,43.16 270 top
C11  79.06,29.3 0 top
C12  91.67,32.13 180 top
C13  65.83,43.16 90 top
C14  73.08,22.36 270 top
C16  59.53,22.05 270 top
C17  75.28,22.36 270 top
C18  96.7,27.72 0 top
C20  68.67,22.36 270 top
C21  96.7,25.52 0 top
C22  91.67,29.93 0 top
C25  89.46,57.96 90 top
C26  91.98,57.96 90 top
FL1  95.45,43.36 0 top
IC1  4.64,43.21 0 top
IC3  106.68,49.53 0 top
IC4  91.67,51.03 180 top
IC5  36.83,36.83 90 top
IC6  11.43,19.05 180 top
J1  102.87,8.89 90 bottom
R1  7.59,44.45 270 top
R2  41.5,14.57 90 top
R3  1.94,44.45 270 top
R4  40.1,28.83 270 top
R5  33.02,54.61 90 top
R6  38.23,13.53 0 top
R7  38.23,15.65 180 top
R8  33.97,15.65 180 top
R9  106.68,60.96 270 top
R10  33.97,13.53 0 top
R11  104.14,60.96 90 top
R12  5.08,22.45 180 top
R13  5.08,20.38 180 top
R14  5.08,16.26 0 top
R15  35.88,28.83 90 top
R16  37.97,28.83 90 top
R17  42.2,28.83 90 top
R18  33.81,28.83 90 top
R19  5.08,18.32 0 top
R20  44.32,28.83 270 top
R21  31.75,28.83 90 top
R22  32.38,41.62 0 top
R23  79.06,44.1 180 top
R24  70.88,22.36 90 top
R31  72.45,43.16 90 top
R33  91.67,34.34 180 top
R34  91.67,38.74 180 top
R35  91.67,36.54 180 top
R36  91.67,25.52 180 top
R37  91.67,27.72 180 top
R38  91.67,23.31 180 top
R39  91.67,40.95 180 top
U$1  38.77,35.15 0 top
U$2  22.86,15.24 0 top
U$4  38.88,2.71 0 top
U$5  69.3,33.08 90 top
X1  41.3,65.83 180 top
X2  107.95,31.75 90 top
X3  31.3,65.83 180 top
X4  53.79,65.83 180 top
X5  18.78,65.83 180 top
X6  16.51,3.81 0 top
X7  68.79,65.83 180 top
X8  6.3,65.83 180 top
X11  82.55,3.81 0 top
X13  114.3,60.96 90 top
XB1  16.38,37.47 90 top

### Tracks (layer width: path | path; a pad name or v marks a point on that pad's centre or on a via)
3.3V
  Top 0.254: IC5.P$1 33.94,34.51 33.69,34.77 33.69,34.86 33.66,34.89 33.66,35.56 33.95,35.85 IC5.P$20
  Top 0.305: IC1.8 3.66,43.65 3.81,43.5
  Top 0.406: 31.43,39.49 C4.1 31.37,41.56 R22.1 | U$2.2 24.57,14.2 24.8,13.97
  Top 0.61: 24.77,38.73 25.4,39.37 31.31,39.37 | 24.77,38.73 12.06,38.73 7.62,34.29 | 7.62,34.29 7.62,26.7 XB1.1 | 24.77,38.73 24.77,29.84 26.8,27.78 26.8,24.86 24.8,22.86 24.8,13.97 U$1.3.3V | 7.62,34.29 7.62,43.47 arc90 R1.2 3.81,43.5 R3.2 C5.1
  Top 0.813: 31.31,39.37 C4.1
  pour Top (isolate 0.254, no thermals): 30.48,40.07 34.07,40.07 34.07,38.86 30.48,38.86
+3V3  (1 unrouted)
  Top 0.254: C13.1 65.83,41.58 67.55,39.87 U$5.44 67.55,37.15 67.56,37.14 | C20.1 68.67,24.57 67.04,26.2 U$5.4 67.04,29.55 67.09,29.61 | 73.08,29.61 73.61,29.82 U$5.18 78.01,29.82 C11.1 | R31.2 | C14.1 73.08,24.34 71.04,26.38 U$5.12 71.05,29.47 71.19,29.61 | C17.1 75.28,23.71 72.56,26.44 U$5.15 | U$5.15 | U$5.15 72.56,29.5 72.45,29.61
  Top 0.406: IC3.4 104.41,43.45 104.14,43.18
  Top 0.61: 73.08,29.61 72.77,29.61 72.45,29.61 71.19,29.61 67.09,29.61 67.09,36.67 | 66.98,29.61 67.04,29.55 | 25MHZ.4 61.42,23.66 61.42,39.06 62.37,40.01 | 25MHZ.1 25MHZ.4 | R23.2 78.11,45.99 | 78.11,45.99 78.11,56.7 77.12,57.66 77.12,60.49 78.75,62.05 95.13,62.05 96.39,60.8 96.39,56.7 | 72.45,45.99 63.63,45.99 63.31,45.99 62.37,45.05 62.37,40.01 | 72.45,45.99 78.11,45.99 | R31.2 72.45,45.99 | 67.09,36.67 65.7,36.67 63.63,38.74 62.37,40.01 | 67.09,36.67 67.56,37.14 | 25MHZ.4 60.18,23.64 C16.1 | 104.14,43.18 104.11,43.16 96.61,43.16 | 96.39,56.7 96.39,43.38 FL1.2 | C26.1 96.25,56.56 96.39,56.7
  Top 1.016: IC4.2 91.64,56.22 C26.1
  pour Top (no thermals): 103.31,43.81 105.85,43.81 105.85,41.37 103.31,41.37
+12V  (via drill 0.4 pad 1.27)
  Top 0.813: R10.2 34.96,13.49 U$1.VIN
  Top 1.27: v118.11,7.62 118.11,67.31 arc90 115.57,69.85 25.4,69.85 arc90 23.74,68.45 X5.1
  Top 1.676: 83.82,7.62 38.35,7.62 36.96,9.02 U$1.VIN 34.99,10.99 C3.1
  other vias: 107.95,5.08 105.41,7.62 107.95,7.62 110.49,7.62 105.41,5.08 97.79,7.62 113.03,5.08 110.49,5.08 113.03,2.54 100.33,5.08 105.41,2.54 115.57,2.54 118.11,2.54 115.57,5.08 118.11,5.08 113.03,7.62 115.57,7.62 100.33,7.62 110.49,2.54 107.95,2.54 97.79,5.08 100.33,2.54 97.79,2.54 95.25,2.54 92.71,2.54 90.17,5.08 87.63,2.54 90.17,2.54 90.17,7.62 87.63,5.08 87.63,7.62 85.09,7.62
  pour Top (no thermals): 82.55,8.89 119.38,8.89 119.38,0 82.55,0
  pour Bottom (no thermals): 82.55,8.89 119.38,8.89 119.38,0 82.55,0
ACTIVITY  (via drill 0.3)
  Top 0.254: U$5.9 69.55,25.89 v69.61,25.83 | v75.6,25.2 75.78,25.02 87.35,25.02 89.06,23.31 R38.2
  Bottom 0.254: v69.61,25.83 70.25,25.2 v75.6,25.2
AT_PARK_PIN  (via drill 0.3, 0.3 pad 0.25)
  Top 0.254: v40.64,40.64 40.04,40.64 39.81,40.42 39.81,39.76 IC5.P$11 | U$1.A5 52.74,13.3 45.72,20.32
  Top 0.406: 45.72,20.32 v45.72,25.4
  Bottom 0.254: 44.45,36.83 v40.64,40.64
  Bottom 0.406: v45.72,25.4 45.72,35.56 44.45,36.83
AT_PARK_PIN_EXT
  Top 0.254: R20.1 44.32,30.92 43.02,32.23 40.07,32.23 39.15,33.15 IC5.P$9 39.15,34.92 39.78,35.56 41.91,35.56 45.18,38.83 45.18,44.58 55.88,55.28 55.88,60.96 57.15,62.23 62.23,62.23 63.5,63.5 66.62,63.5 X7.2
AT_PARK_PIN_LOOP  (via drill 0.3 pad 0.25)
  Top 0.254: v29.21,19.05 45.72,19.05 50.16,14.61 50.2,14.57 U$1.A4 | v23.53,19.05 v20.32,19.05 | v15.24,19.05 15.24,19.02 14.99,18.76 IC6.P$5
  Bottom 0.254: v29.21,19.05 v23.53,19.05 | v20.32,19.05 v15.24,19.05
AT_PARK_PIN_LOOP_EXT  (via drill 0.3 pad 0.25)
  Top 0.254: IC6.P$15 8.11,19.41 7.4,20.13 7.4,21.81 6.99,22.23 6.35,22.86 8.38,24.89 8.38,25.02 8.38,26.99 8.45,27.05 v8.45,32.99 | 6.35,22.77 R12.1 | X7.3 63.84,68.24 63.5,68.58 v26.67,68.58 | v21.59,68.58 12.7,68.58 11.43,67.31 11.43,61.34 11.84,60.93 11.84,52.9 8.38,49.44 8.38,47.5 10.16,45.72 10.16,43.18 v8.89,41.91
  Top 0.305: 6.35,22.86 6.35,22.77
  Bottom 0.254: v26.67,68.58 v21.59,68.58 | v8.89,41.91 8.45,41.47 v8.45,32.99
AVDD  (via drill 0.3)
  Top 0.61: v89.14,36.54 R35.2 | R34.2 v89.14,38.74 | R33.2 v89.14,34.34 | FL1.1 94.5,42.22 v94.5,41.9
  Bottom 0.61: v89.14,38.74 v89.14,36.54 | v89.14,34.34 v89.14,36.54 | v89.14,36.54 93.24,36.54 94.5,37.8 v94.5,41.9
BUF_EN  (via drill 0.3 pad 0.25)
  Top 0.254: IC5.P$19 34.59,40.36 R22.2 33.5,41.78 33.5,43.34 33.02,43.69 v30.7,43.69 | v33.02,17.78 45.72,17.78 47.62,15.88 47.66,15.84 U$1.A3
  Bottom 0.254: v33.02,17.78 33.02,17.91 30.7,20.23 v30.7,43.69
BUTTON_EAST_OPEN
  Top 0.254: IC5.P$15 37.24,39.79 37.24,41.94 40.01,44.7 40.01,59.24 U$1.5
BUTTON_EAST_OPEN_5V
  Top 0.254: R16.2 37.97,31.75 36.55,33.18 IC5.P$5 36.54,36.07 37.31,36.83 41.91,36.83 44.45,39.37 44.45,44.45 44.45,44.86 55.12,55.53 55.12,62.99 53.79,64.32 X4.2
BUTTON_WEST_CLOSE
  Top 0.254: IC5.P$16 36.51,39.77 36.51,43.24 37.47,44.2 37.47,59.24 U$1.6
BUTTON_WEST_CLOSE_5V
  Top 0.254: R15.2 35.9,29.8 IC5.P$4 35.88,33.91 35.88,36.58 37.4,38.1 41.91,38.1 43.18,39.37 43.18,44.45 54.61,55.88 54.61,60.96 52.07,63.5 49.77,65.83 X4.3
D13  (via drill 0.3 pad 0.25)
  Top 0.254: IC5.P$18 35.24,43.82 35.4,43.97 35.4,50.96 v34.29,52.07
  Bottom 0.254: v34.29,52.07 24.13,52.07 18.16,58.04 18.19,58.07 U$1.13
D13_EXT  (via drill 0.3 pad 0.25)
  Top 0.254: R21.2 31.75,31.75 32.64,32.64 33.78,32.64 34.59,33.45 IC5.P$2 34.58,33.91 v34.58,35.02 | v9.3,57.21 9.3,61.85 8.89,62.23 5.08,62.23 3.79,63.52 X8.2
  Bottom 0.254: v9.3,57.21 15.68,50.8 27.94,50.8 31.75,46.99 31.75,35.56 32,35.31 33.02,35.31 | 33.02,35.31 33.15,35.31 | v34.58,35.02 34.29,35.31 33.02,35.31
DTR_DSR_DCD  (via drill 0.3)
  Top 0.254: IC3.2 103.11,47.23 104.14,48.26 v106.68,48.26 | v107.66,44.45 107.66,45.9 | IC3.9 IC3.10
  Top 0.305: 107.66,45.9 IC3.9
  Bottom 0.254: v106.68,48.26 107.19,48.26 107.66,47.78 v107.66,44.45
ETH_CS  (via drill 0.3)
  Top 0.254: R31.1 72.55,42.1 U$5.34 72.55,31.92 v72.45,31.82 | U$1.52 69.25,18.64 v68.36,19.53
  Bottom 0.254: v68.36,19.53 68.36,27.72 v72.45,31.82
GND  (via drill 0.3 pad 0.25, 0.6 pad 1.27)
  other vias: 41.91,34.29 26.67,38.1 34.29,24.13 26.67,30.48 33.02,48.26 30.86,57.4 27.3,57.4 21.59,43.18 17.78,34.29 108.14,57.94 12.7,50.8 11.43,21.59 104.14,57.15 50.8,17.78 40.64,24.13 43.16,54.81 34.96,38.23 51.03,54.81 21.59,34.29 3.81,34.29 31.75,34.29 107.95,49.53 9.86,24.45 13.97,12.7 25.94,16.61 6.35,8.89 10.38,15.91 64.77,1.27 68.58,1.27 72.39,1.27 76.2,1.27 2.54,50.8 6.35,55.88 38.1,11.43 37.18,35.05 113.4,34.34 113.4,29.3 91.67,51.03 88.2,31.98 63.63,16.7 66.15,16.7 68.67,16.7 81.27,32.45 60.96,1.27 57.15,1.27 53.34,1.27 49.53,1.27 45.72,1.27 41.91,1.27 38.1,1.27 34.29,1.27 30.48,1.27 5.08,1.27 1.27,1.27 1.27,5.08 1.27,8.89 11.43,3.81 6.35,3.81 16.51,3.81 21.59,3.81 26.67,3.81 93.97,60.84 96.57,39.56 93.97,17.15 100.33,46.99 61.11,51.66 77.11,26.57 86,63.63 64.35,39.81 87.57,60.8 63.72,27.16 91.44,44.45 76.94,38.35 68.41,34.66 70.25,44.1 70.93,31.8 68.41,31.78 70.97,34.7 63.63,44.1 74.97,44.1
  pour Bottom (rank 2, no thermals): 0,0 0,71.12 119.38,71.12 119.38,0
  pour Top (rank 2, no thermals): 0,0 0,71.12 119.38,71.12 119.38,0
HOME_SHUTTER_CLOSED  (via drill 0.3 pad 0.25)
  Top 0.254: v46.99,53.34 47.62,53.98 47.62,59.24 U$1.2 | 35.88,39.76 IC5.P$17 35.88,39.76 | v35.88,51.91 35.88,39.76
  Bottom 0.254: v46.99,53.34 37.31,53.34 v35.88,51.91
HOME_SHUTTER_CLOSED_5V  (via drill 0.3 pad 0.25)
  Top 0.254: R18.2 33.81,31.72 35.24,33.15 IC5.P$3 35.21,33.92 35.21,36.8 37.15,38.77 40.96,38.77 41.91,39.75 v41.91,43.18 | v41.31,60.99 41.31,46.35 v41.91,45.72
  Bottom 0.254: v41.91,45.72 v41.91,43.18 | X1.2 41.31,63.31 v41.31,60.99
INT_N  (via drill 0.3)
  Top 0.254: U$1.32 80.08,44.04 R23.1 v80.02,39.06 | v80.02,39.06 v80.01,39.06 | U$5.24 75.98,32.82 76.23,33.08 76.23,35.59 77.49,36.85 v80.01,36.85 v80.02,36.86 v80.02,39.06
LINK_ACK  (via drill 0.3)
  Top 0.254: U$5.10 70.06,28.48 v70.25,28.66 | v87.25,40.23 87.97,40.95 R39.2
  Bottom 0.254: v70.25,28.66 73.08,31.5 73.08,35.91 73.08,36.85 76.23,40.01 76.45,40.23 v87.25,40.23
M_DIR  (via drill 0.3 pad 0.25)
  Top 0.254: v22.86,40.64 24.38,42.16 24.38,49.59 23.24,50.74 23.24,59.24 U$1.11 | v19.05,35.56 19.05,28.16 18.38,27.5 18.38,20.1 15.72,17.43 14.4,17.43 IC6.P$3
  Bottom 0.254: v22.86,40.64 19.05,36.83 v19.05,35.56
M_DIR_5V
  Top 0.254: R19.2 6.24,18.11 IC6.P$17 10.3,18.11 12.06,16.35 12.06,8.26 13.97,6.35 13.97,3.83 X6.3
M_EN  (via drill 0.3 pad 0.25)
  Top 0.254: v24.13,40.64 26.67,43.18 26.67,50.8 25.78,51.69 25.78,59.24 U$1.10 | v20.32,35.56 20.32,27.02 20.38,26.96 20.38,20.99 16.22,16.83 14.38,16.83 IC6.P$2
  Bottom 0.254: v24.13,40.64 24.13,39.37 v20.32,35.56
M_EN_5V
  Top 0.254: R14.2 6.7,16.92 7.24,16.92 7.78,17.46 IC6.P$18 10.26,17.46 11.43,16.29 11.43,11.43 3.99,3.99 X6.1
M_STEP  (via drill 0.3 pad 0.25)
  Top 0.254: v19.56,46.1 20.38,46.93 20.38,49.56 20.7,49.88 20.7,59.24 U$1.12 | v16.51,35.56 16.51,27.37 16.38,27.24 16.38,19.24 15.24,18.1 14.39,18.1 IC6.P$4
  Bottom 0.254: v19.56,46.1 19.56,41.15 16.51,38.1 v16.51,35.56
M_STEP_5V
  Top 0.254: R13.1 6.67,19.75 6.86,19.75 7.84,18.77 IC6.P$16 10.45,18.77 12.7,16.51 12.7,11.43 16.51,7.62 22.86,7.62 24.13,6.35 24.13,3.91 X6.5
N$1
  Top 0.406: IC3.19 108.31,55.52 106.68,57.15 R9.2
  Top 1.016: R11.1 R9.2
N$2
  Top 0.813: R8.1 R7.2
N$3
  Top 0.813: R8.2 R10.1
N$5
  Top 0.813: R7.1 41.37,15.65 R2.2
N$6
  Top 0.406: IC3.17 109.61,51.69 110.49,50.8 112.9,50.8 C8.1
N$7
  Top 0.254: U$5.11 70.55,23.64 R24.2
N$8
  Top 0.254: U$5.43 68.04,38.69 C10.2
N$9
  Bottom 0.254: XB1.16 16.86,46.99 21.59,46.99 23.07,48.47 XB1.12
N$10  (via drill 0.3)
  Top 0.254: v98.28,40.95 R39.1
  Bottom 0.254: X2.9 100.58,38.65 v98.28,40.95
N$13  (via drill 0.3)
  Top 0.305: X2.6 107.87,29.93 v94.19,29.93 | v89.46,29.93 C22.1 R37.2 R36.2
  Bottom 0.305: v94.19,29.93 v89.46,29.93
N$14  (via drill 0.3)
  Top 0.254: v98.59,23.31 R38.1
  Bottom 0.254: X2.12 100.58,25.3 v98.59,23.31
N$16
  Top 0.254: C18.2 104.56,27.72 X2.7
N$17
  Top 0.254: X2.8 105.84,25.2 98.28,25.2
  Top 0.305: 98.28,25.2 97.97,25.52 C21.2
N$18
  Top 0.305: X2.3 105.14,33.39 97.33,33.39 96.39,34.34 R33.1 C12.1
RESET
  Top 0.406: U$2.1 21.92,11.35 U$1.RESET
RG-11  (via drill 0.3 pad 0.25)
  Top 0.254: v36.67,44.8 36.67,57.63 36.61,57.63 U$1.7 | IC5.P$13 38.49,40.82 v38.13,41.18
  Bottom 0.254: v38.13,41.18 38.13,43.34 v36.67,44.8
RG-11-IN_5V  (via drill 0.3 pad 0.25)
  Top 0.254: R4.1 40.1,30.39 37.84,32.64 IC5.P$7 37.81,33.92 v37.81,36.07 | R5.1 33.02,52.07 30.48,49.53 30.48,45.72 29.21,44.45 v29.21,40.64 | v29.21,36.83 29.78,36.26 32.89,36.26 v32.92,36.23
  Top 0.813: C1.1 R5.1
  Bottom 0.254: v29.21,40.64 v29.21,36.83 | v32.92,36.23 37.66,36.23 v37.81,36.07
RG-11-IN_EXT
  Top 0.813: R5.2 33.02,60.96 31.75,62.23 20.32,62.23 18.82,63.68 X5.2
RTS_CTS
  Top 0.254: IC3.3 103.75,47.15 104.11,47.5 108.71,47.5 108.97,47.24 IC3.11
RX2  (via drill 0.3)
  Top 0.254: v81.28,66.04 95.25,66.04 99.06,62.23 99.06,51.34 102.46,47.94 IC3.1 | U$1.17 65.44,60.99 65.88,61.44 76.68,61.44 v78.74,63.5
  Top 0.305: IC3.1
  Bottom 0.254: v78.74,63.5 v81.28,66.04
RXN  (via drill 0.3)
  Top 0.254: U$5.21 77.67,31.32 v77.81,31.18 | R36.1 v94.19,25.52 C21.1
  Bottom 0.254: v77.81,31.18 78.44,30.55 80.95,28.04 81.46,27.53 87.12,27.53 89.14,25.52 91.67,25.52 v94.19,25.52
RXP  (via drill 0.3)
  Top 0.254: U$5.20 76.92,30.81 77.17,30.55 82.03,30.55 82.54,30.05 88.08,30.05 v89.14,28.98 | R37.1 v94.19,27.72 C18.1
  Bottom 0.254: v89.14,28.98 90.41,27.72 v94.19,27.72
SCL
  Top 0.305: IC1.6 4.96,46.99 | 4.96,46.99 4.96,50.68 6.35,52.07 7.62,52.07 8,52.45 8,59.24 U$1.SCL1 | R3.1 1.94,46.99 2.22,47.28 4.67,47.28 4.96,46.99
SCLK  (via drill 0.3)
  Top 0.254: v70.25,37.17 70.74,37.17 71.05,37.48 U$5.37
  Bottom 0.254: U$1.SCK 53.99,37.67 68.81,37.67 69.31,37.17 v70.25,37.17
SDA
  Top 0.305: R1.1 6.85,46.14 IC1.5 5.65,46.18 5.65,49.53 6.92,50.8 8.89,50.8 10.54,52.45 10.54,59.24 U$1.SDA1
SDI  (via drill 0.3)
  Top 0.254: v71.82,40.32 72.04,40.1 U$5.35
  Bottom 0.254: U$1.MISO 52.74,40.14 53.55,40.95 71.19,40.95 v71.82,40.32
SDO  (via drill 0.3)
  Top 0.254: v71.19,36.54 71.56,36.91 U$5.36
  Bottom 0.254: U$1.MOSI 55.4,36.54 v71.19,36.54
SHUTTER_OPENED
  Top 0.254: IC5.P$12 39.15,41.37 45.09,47.31 45.09,59.24 U$1.3
SHUTTER_OPENED_5V  (via drill 0.3 pad 0.25)
  Top 0.254: R17.2 42.2,30.89 41.37,31.72 39.81,31.72 38.49,33.04 IC5.P$8 38.48,33.9 v38.48,35.34 | v36.23,60.9 33.59,63.5 31.12,63.5 X3.2 | v38.61,55.88 38.61,44.83 v38.67,44.77
  Bottom 0.254: v36.23,60.9 36.23,58.17 v38.61,55.88 | v38.67,44.77 38.67,43.88 39.37,43.18 39.37,36.23 v38.48,35.34
TX2  (via drill 0.3)
  Top 0.254: v99.06,44.45 97.79,45.72 97.79,62.23 95.25,64.77 82.55,64.77 78.74,64.77 76.2,62.23 64.1,62.23 62.9,61.02 U$1.16 | v105.41,44.45 105.06,44.8 IC3.5
  Top 0.406: IC3.5
  Bottom 0.254: v99.06,44.45 v105.41,44.45
TXN  (via drill 0.3)
  Top 0.254: U$5.17 74.93,29.3 75.92,29.3 v76.23,28.98 | v76.86,34.34 77.69,35.16 86.72,35.16 87.02,35.46 92.1,35.46 92.61,35.98 R35.1 99.22,36.54 99.86,35.91 102.69,35.91 103.64,34.97 107.91,34.97 X2.2
  Bottom 0.254: v76.86,34.34 76.86,29.93 76.86,29.61 v76.23,28.98
TXP  (via drill 0.3)
  Top 0.254: U$5.16 73.06,28.01 v73.71,28.66 | 92.61,38.38 91.87,37.64 88.98,37.64 v87.89,36.54 | 92.61,38.38 R34.1 | 92.61,38.38 103.22,38.38 X2.1
  Bottom 0.254: v73.71,28.66 73.71,34.02 74.85,35.16 86.47,35.16 87.85,36.54 v87.89,36.54
USB_VCC
  Top 1.016: X13.1 106.85,62.21 R9.1
USBDM
  Top 0.406: X13.2 109.59,55 110.27,54.32 IC3.16
USBDP
  Top 0.406: X13.3 111.59,54.98 110.9,54.29 IC3.15
VCC  (via drill 0.3, 0.3 pad 0.25, 0.3 pad 0.81)  (1 unrouted)
  Top 0.254: v16.92,14.38 15.14,16.16 IC6.P$1
  Top 0.406: IC3.20 107.66,54.91 107.19,55.37 C7.1
  Top 0.61: C6.1 | C6.1 4.67,14.29 4.16,14.79 4.16,16.22 R14.1 R19.1 R13.2 | v10,14.38 8.61,14.38 C6.1 | 8.89,3.71 8.89,2.54 10.48,0.95 19.05,0.95 28.38,0.95 29.03,1.6 X6.6 29.03,7.8 27.3,9.53 27.34,9.56 U$1.5V 27.3,11.05 v27.3,20.95 29.21,22.86 29.21,26.67 30.48,27.94 31.69,27.94 R21.1 R18.1 R15.1 R16.1 | X6.4 19.02,0.98 | R13.2 3.87,20.38 3.81,20.32 | R13.2 R12.2 | U$1.5V.. 85.94,59.28 86,59.22 | v105.39,58.05 105.39,55.61 C7.1
  Top 0.813: 8.89,3.71 X6.2 | 19.02,0.98 19.05,0.95 | C6.1 | R16.1 R4.2 R17.1 R20.2 | U$1.5V. U$1.5V.. 87.25,59.28 87.57,58.96 87.57,56.7 87.71,56.56 C25.1
  Top 1.016: IC4.3 89.35,56.45 C25.1
  Bottom 0.406: U$1.5V. U$1.5V..
  Bottom 0.61: v27.3,20.95 23.5,20.95 v20.32,17.78 v16.92,14.38 v10,14.38 | U$1.5V.. 101.06,59.28 102.06,58.27 105.16,58.27 v105.39,58.05
  pour Top (no thermals): 7.75,16.22 9.4,16.22 9.4,13.65 7.75,13.65
VPIN
  Top 0.813: R2.1 41.4,13.53 R6.2 39.97,12.73 39.97,11.08 U$1.A0
XBEE_DIN  (via drill 0.3)
  Top 0.254: v51.69,62.23 v36.83,62.23 | v11.43,41.02 11.43,41.53 12.83,42.93 17.91,42.93 22.38,47.4 22.38,49.59 22,50.01 v22,60.96
  Bottom 0.254: v36.83,62.23 22.86,62.23 v22,60.96 | v11.43,41.02 11.43,26.51 | v51.69,62.23 67.06,62.23 67.94,61.34 67.98,61.31 U$1.18
  Bottom 0.305: 11.43,26.51 XB1.3
XBEE_DOUT  (via drill 0.3)
  Top 0.254: v50.42,63.25 v36.83,63.25 | v9.4,38.1 9.4,40.51 13.21,44.32 17.27,44.32 18.41,45.47 18.41,49.56 19.46,50.58 v19.46,60.99
  Bottom 0.254: v36.83,63.25 20.95,63.25 v19.46,60.99 | v9.4,38.1 9.4,26.48 XB1.2 | v50.42,63.25 69.47,63.25 70.48,62.23 70.52,62.2 U$1.19
XBEE_RESET  (via drill 0.3)
  Top 0.254: v17.78,36.83 16.51,36.83 15.24,35.56 15.24,26.61 XB1.5 | v29.21,48.26 29.21,57.72 29.34,57.72 U$1.8
  Bottom 0.254: v29.21,48.26 v17.78,36.83
XI
  Top 0.254: U$5.3 66.56,23.72 25MHZ.3

### Text on the board
tPlace: D13 | GND | GND | RG-11 | 12V | Opened | GND | Home/Closed | GND | GND | AT_PARK_PIN_EXT | GND | AT_PARK_PIN_LOOP_EXT | East / Open | West / Close | GND | +12V
bPlace: East / Open | AT_PARK_PIN_LOOP_EXT | D13 | GND | GND | RG-11 | 12V | Opened | GND | Home/Closed | GND | West / Close | GND | AT_PARK_PIN_EXT | GND
tDocu: Dome Rotator